# Altium project Quick start  Help for beginners.PrjPcb
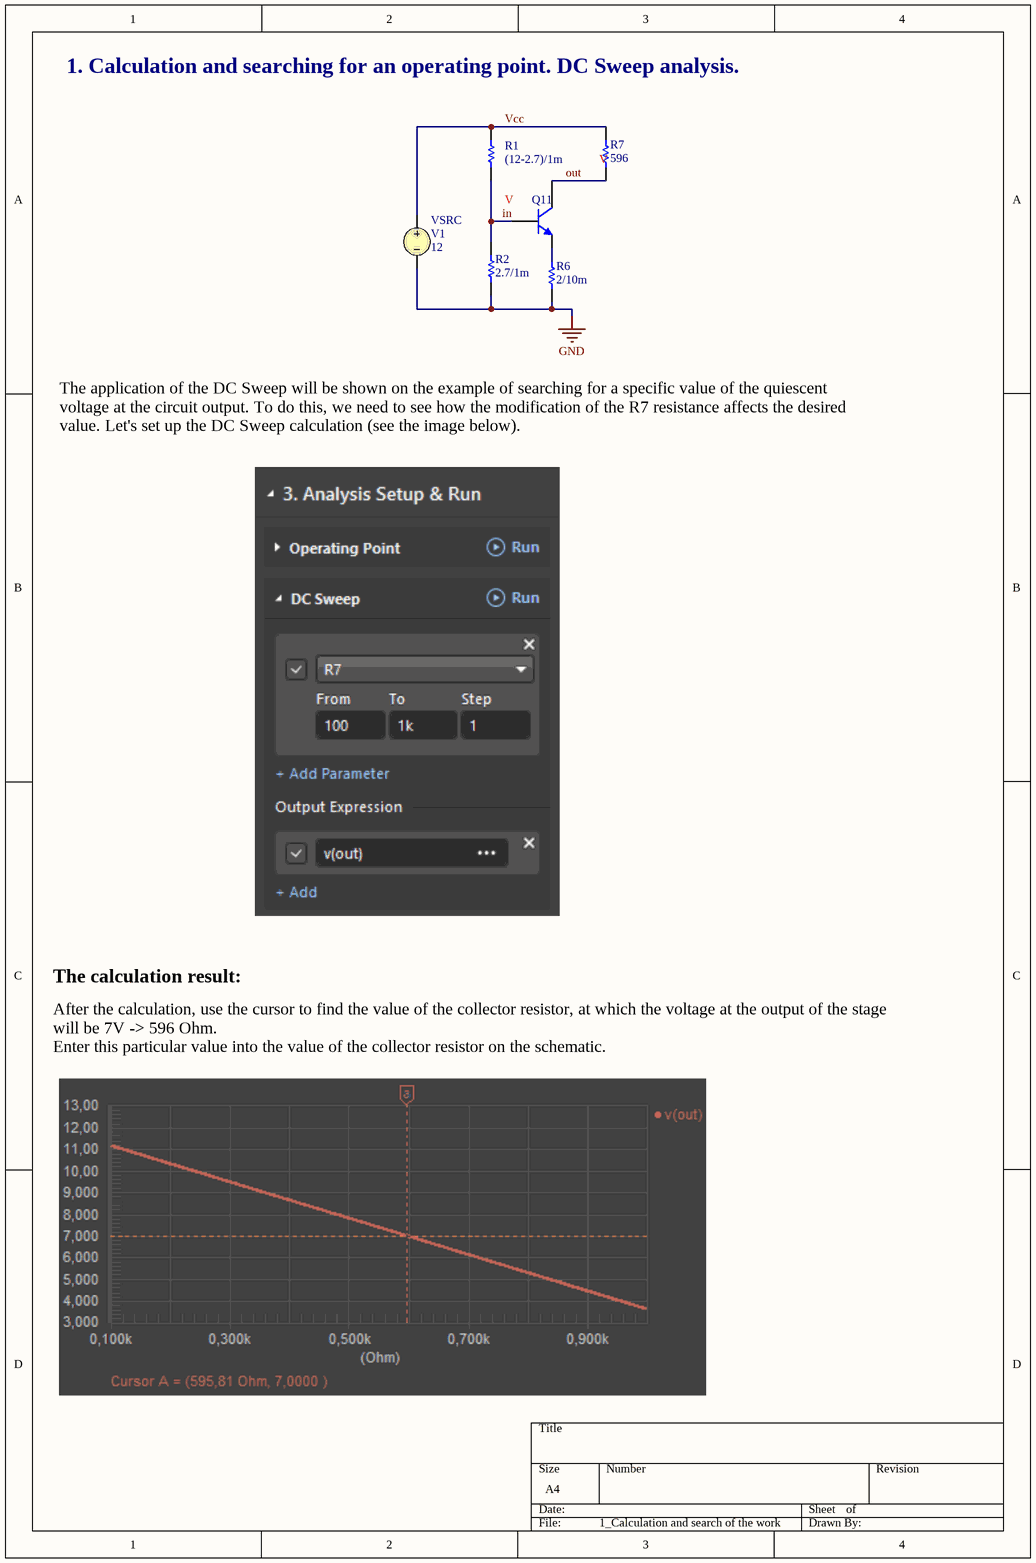
[diagram p0: 1_Calculation and search of the working point.SchDoc]
1 sheet, 6 parts. Net scope: global (net labels, ports and power ports of the same name join across sheets).

## Sheet 1_Calculation and search of the working point.SchDoc
size A4 portrait; SheetNumber: 1; SheetTotal: 1; SPICEModelCacheCSPBSJPQ: <root> / <DocumentId>CSPBSJPQ</DocumentId> / </root>

### Parts
Q11  Bipolar  NPN 3 Pins  Transistor  Modified Version of the Gummel-Poon Model  (value not drawn)
R1  value (12-2.7)/1m  (hidden comment: Resistor)
R2  value 2.7/1m  (hidden comment: Resistor)
R6  value 2/10m  (hidden comment: Resistor)
R7  value 596  (hidden comment: Resistor)
V1  VSRC  value 12

### Nets
GND: R2.2 R6.1 V1.2
in: Q11.2(B) R1.1 R2.1
out: Q11.1(C) R7.1
Vcc: R1.2 R7.2 V1.1
NetQ11_3: Q11.3(E) R6.2

### Notes on the sheet
- 1. Calculation and searching for an operating point. DC Sweep analysis.
- The application of the DC Sweep will be shown on the example of searching for a specific value of the quiescent voltage at the circuit output. To do this, we need to see how the modification of the R7 resistance affects the desired value. Let's set up the DC Sweep calculation (see the image below).
- The calculation result:
- After the calculation, use the cursor to find the value of the collector resistor, at which the voltage at the output of the stage will be 7V -> 596 Ohm.
  Enter this particular value into the value of the collector resistor on the schematic.

### Library data of the parts
Q11 = BJT NPN_MGP: BF: 100; AF: 0; BR: 1; EG: 1.11; FC: 0.5; IS: 1e-16; MJC: 0.33; NC: 2; NE: 1.5; TNOM: 27; VBC_MAX: 1e99; VJC: 0.75; XTI: 3; SimulationGenericComponent: True; CJC: 0; CJE: 0; CJS: 0; CTC: 0; CTE: 0; CTS: 0; IKF: 0; IKR: 0; IRB: 0; ISC: 0; ISE: 0; ISS: 0; ITF: 0; KF: 0; MJE: 0.33; MJS: 0; NF: 1; NKF: 0.5; NR: 1; NS: 1; PTF: 0; RB: 0; RBM: 0; RC: 0; RE: 0; SUBS: 1; TBF1: 0; TBF2: 0; TBR1: 0; TBR2: 0; TF: 0; TIKF1: 0; TIKF2: 0; TIKR1: 0; TIKR2: 0; TIRB1: 0; TIRB2: 0; TIS1: 0; TIS2: 0; TISC1: 0; TISC2: 0; TISE1: 0; TISE2: 0; TITF1: 0; TITF2: 0; TLEV: 0; TLEVC: 0; TMJC1: 0; TMJC2: 0; TMJE1: 0; TMJE2: 0; TMJS1: 0; TMJS2: 0; TNC1: 0; TNC2: 0; TNE1: 0; TNE2: 0; TNF1: 0; TNF2: 0; TNR1: 0; TNR2: 0; TNS1: 0; TNS2: 0; TR: 0; TRB1: 0; TRB2: 0; TRC1: 0; TRC2: 0; TRE1: 0; TRE2: 0; TRM1: 0; TRM2: 0; TTF1: 0; TTF2: 0; TTR1: 0; TTR2: 0; TVAF1: 0; TVAF2: 0; TVAR1: 0; TVAR2: 0; TVJC: 0; TVJE: 0; TVJS: 0; VAF: 0; VAR: 0; VBE_MAX: 1e99; VCE_MAX: 1e99; VJE: 0.75; VJS: 0.75; VTF: 0; XCJC: 1; XTB: 0; XTF: 0
V1 = VSRC: Voltage Source; Note: PCB Footprint - Not required; AC Magnitude: 0; Published: 30-July-2020; LatestRevisionDate: 30-July-2020; LatestRevisionNote: Re-released for DXP Platform.; PackageReference: Not Applicable; Publisher: Altium Limited